# Altium schematic sheet LED Connection.SchDoc
size 420 x 297 mm; Address1: Address1; Address2: Address2; Address3: Address3; Address4: Address4; DocumentNumber: АБВГ.123456.001 Э3; SheetNumber: 2; Scale: 1:1; DocumentType: Схема электрическая принципиальная; FirstReferrence: АБВГ.123456.001
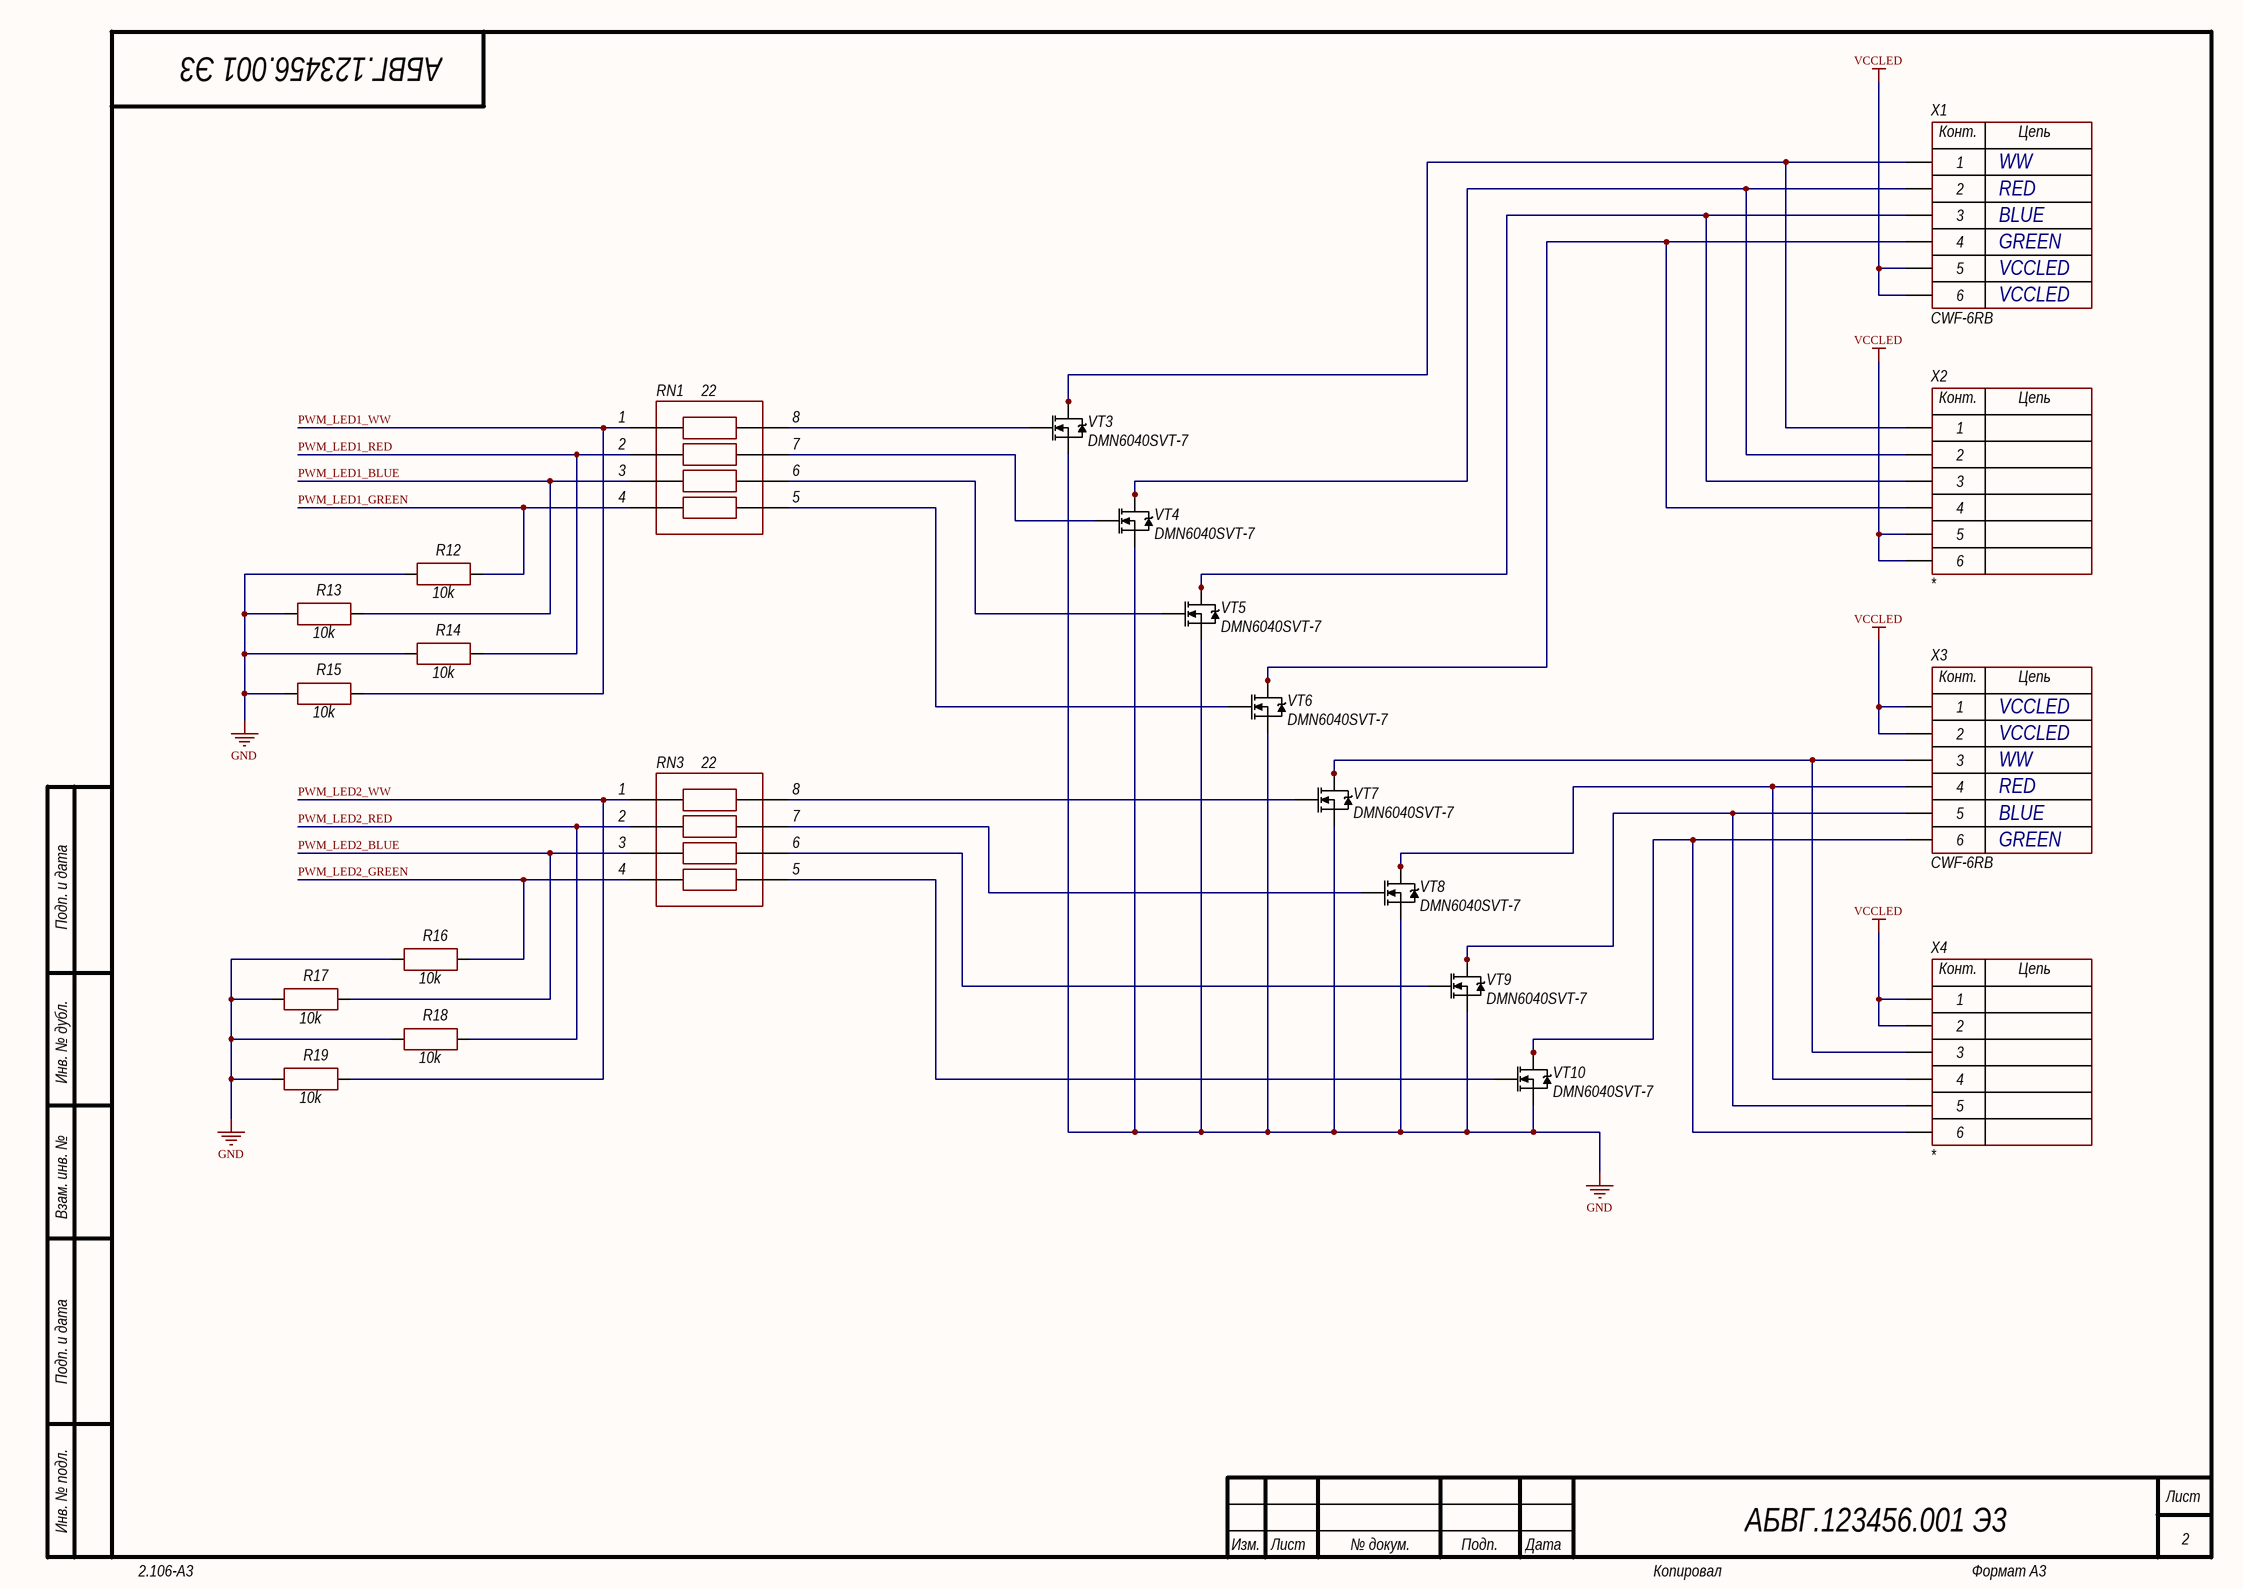
[diagram p0: LED Connection.SchDoc]

## Parts
R12  10k  [CH0603R]
R13  10k  [CH0603R]
R14  10k  [CH0603R]
R15  10k  [CH0603R]
R16  10k  [CH0603R]
R17  10k  [CH0603R]
R18  10k  [CH0603R]
R19  10k  [CH0603R]
RN1  22  [CH0603Rx4 (1206)]
RN3  22  [CH0603Rx4 (1206)]
VT3  DMN6040SVT-7  [TSOT23-6]
VT4  DMN6040SVT-7  [TSOT23-6]
VT5  DMN6040SVT-7  [TSOT23-6]
VT6  DMN6040SVT-7  [TSOT23-6]
VT7  DMN6040SVT-7  [TSOT23-6]
VT8  DMN6040SVT-7  [TSOT23-6]
VT9  DMN6040SVT-7  [TSOT23-6]
VT10  DMN6040SVT-7  [TSOT23-6]
X1  CWF-6RB  [CON: CWF-6RB]
X2  *  [CON: PBS-6]
X3  CWF-6RB  [CON: CWF-6RB]
X4  *  [CON: PBS-6]

## Nets
GND: R12.1 R13.1 R14.1 R15.1 R16.1 R17.1 R18.1 R19.1 VT3.4(S) VT4.4(S) VT5.4(S) VT6.4(S) VT7.4(S) VT8.4(S) VT9.4(S) VT10.4(S)
VCCLED: X1.5 X1.6 X2.5 X2.6 X3.1 X3.2 X4.1 X4.2
PWM_LED1_BLUE: R13.2 RN1.3
PWM_LED1_GREEN: R12.2 RN1.4
PWM_LED1_RED: R14.2 RN1.2
PWM_LED1_WW: R15.2 RN1.1
PWM_LED2_BLUE: R17.2 RN3.3
PWM_LED2_GREEN: R16.2 RN3.4
PWM_LED2_RED: R18.2 RN3.2
PWM_LED2_WW: R19.2 RN3.1
NetRN1_5: RN1.5 VT6.3(G)
NetRN1_6: RN1.6 VT5.3(G)
NetRN1_7: RN1.7 VT4.3(G)
NetRN1_8: RN1.8 VT3.3(G)
NetRN3_5: RN3.5 VT10.3(G)
NetRN3_6: RN3.6 VT9.3(G)
NetRN3_7: RN3.7 VT8.3(G)
NetRN3_8: RN3.8 VT7.3(G)
NetVT3_1: VT3.1(D) VT3.2(D) VT3.5(D) VT3.6(D) X1.1 X2.1
NetVT4_1: VT4.1(D) VT4.2(D) VT4.5(D) VT4.6(D) X1.2 X2.2
NetVT5_1: VT5.1(D) VT5.2(D) VT5.5(D) VT5.6(D) X1.3 X2.3
NetVT6_1: VT6.1(D) VT6.2(D) VT6.5(D) VT6.6(D) X1.4 X2.4
NetVT7_1: VT7.1(D) VT7.2(D) VT7.5(D) VT7.6(D) X3.3 X4.3
NetVT8_1: VT8.1(D) VT8.2(D) VT8.5(D) VT8.6(D) X3.4 X4.4
NetVT9_1: VT9.1(D) VT9.2(D) VT9.5(D) VT9.6(D) X3.5 X4.5
NetVT10_1: VT10.1(D) VT10.2(D) VT10.5(D) VT10.6(D) X3.6 X4.6

## Notes on the sheet
- WW
- RED
- BLUE
- GREEN
- VCCLED
- Подп. и дата
- Инв. № дубл.
- Взам. инв. №
- Инв. № подл.
- Изм.
- Лист
- № докум.
- Подп.
- Дата
- 2.106-A3
- Копировал
- Формат А3
- (in symbol 6-Connector) Конт.; Цепь

## Library data of the parts
R12-R19 = Resistor: Manufacturer: *; Model: *; HelpURL: *; ComponentKind: *; Value: 10k
RN1 RN3 = Resistor assembly: Manufacturer: Bourns GmbH.; Model: CAT16-J4; HelpURL: https://www.terraelectronica.ru/pdf/show?pdf_file=https%253A%252F%252Fwww.mouser.com%252Fds%252F2%252F54%252FATCAY-777361.pdf; ComponentKind: *; Value: 22
VT3-VT10 = DMN6040SVT-7: Mosfet; Manufacturer: Diodes Incorporated; Model: DMN6040SVT-7; ComponentKind: 60V 5A; HelpURL: https://www.diodes.com/assets/Datasheets/DMN6040SVT.pdf
X1-X4 = 6-Connector: Manufacturer: *; HelpURL: *; ComponentKind: *
  X1 X3: Model: CWF-6RB
  X2 X4: Model: *